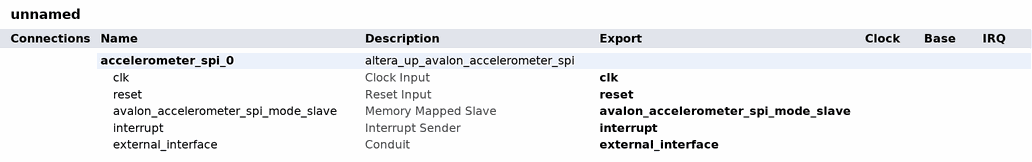
[diagram p0: system contents]
# Platform Designer (Qsys) system unnamed, MAX 10 10M50DAF484C7G
# Parameters at their usual value, and those the tool derives, are not listed.
package require -exact qsys 18.0
create_system unnamed
set_project_property DEVICE_FAMILY {MAX 10}
set_project_property DEVICE 10M50DAF484C7G

add_instance accelerometer_spi_0 altera_up_avalon_accelerometer_spi 18.0
set_instance_property accelerometer_spi_0 AUTO_EXPORT true

# exported interfaces
add_interface avalon_accelerometer_spi_mode_slave avalon slave
set_interface_property avalon_accelerometer_spi_mode_slave EXPORT_OF accelerometer_spi_0.avalon_accelerometer_spi_mode_slave
add_interface clk clock sink
set_interface_property clk EXPORT_OF accelerometer_spi_0.clk
add_interface external_interface conduit end
set_interface_property external_interface EXPORT_OF accelerometer_spi_0.external_interface
add_interface interrupt interrupt sender
set_interface_property interrupt EXPORT_OF accelerometer_spi_0.interrupt
add_interface reset reset sink
set_interface_property reset EXPORT_OF accelerometer_spi_0.reset

set_interconnect_requirement {$system} qsys_mm.clockCrossingAdapter HANDSHAKE
set_interconnect_requirement {$system} qsys_mm.enableEccProtection FALSE
set_interconnect_requirement {$system} qsys_mm.insertDefaultSlave FALSE
set_interconnect_requirement {$system} qsys_mm.maxAdditionalLatency 1

save_system unnamed.qsys
